# Altium schematic sheet Input.SchDoc
size A4; SheetNumber: 3; SheetTotal: 6
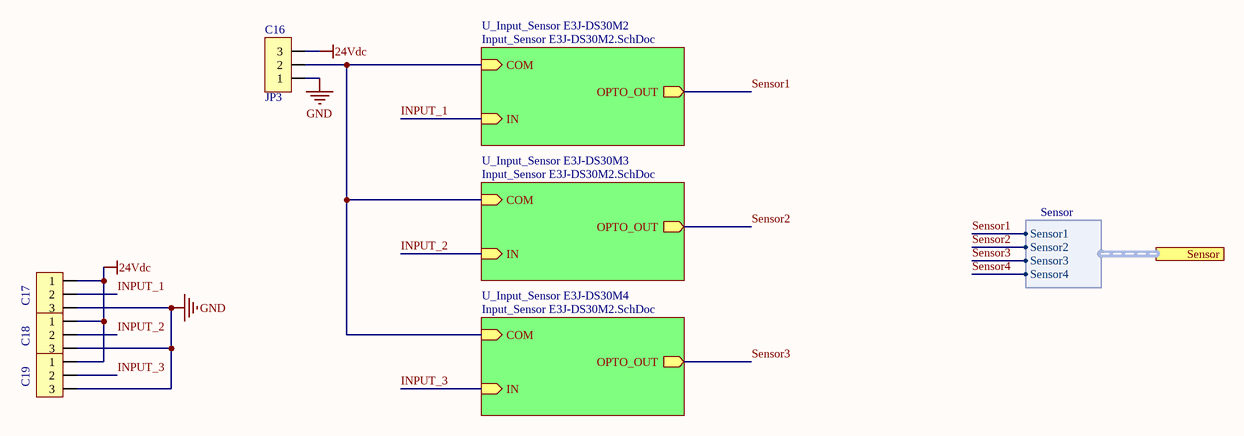
[diagram p0: Input.SchDoc]

## Parts
C16  JP3  [JP3-CLOSED]
C17  Header3  [Header3 90]  (value not drawn)
C18  Header3  [Header3 90]  (value not drawn)
C19  Header3  [Header3 90]  (value not drawn)

## Sub-sheets
U_Input_Sensor E3J-DS30M2 = Input_Sensor E3J-DS30M2.SchDoc: COM (in), IN (in), OPTO_OUT (out)
U_Input_Sensor E3J-DS30M3 = Input_Sensor E3J-DS30M2.SchDoc: COM (in), IN (in), OPTO_OUT (out)
U_Input_Sensor E3J-DS30M4 = Input_Sensor E3J-DS30M2.SchDoc: COM (in), IN (in), OPTO_OUT (out)

## Ports
Sensor (harness Sensor)

## Harnesses
Sensor: Sensor1, Sensor2, Sensor3, Sensor4

## Nets
24Vdc: C16.3 C17.1 C18.1 C19.1
GND: C16.1 C17.3 C18.3 C19.3
INPUT_1: C17.2 ; sheet U_Input_Sensor E3J-DS30M2/IN
INPUT_2: C18.2 ; sheet U_Input_Sensor E3J-DS30M3/IN
INPUT_3: C19.2 ; sheet U_Input_Sensor E3J-DS30M4/IN
Sensor1: sheet U_Input_Sensor E3J-DS30M2/OPTO_OUT, port Sensor.Sensor1
Sensor2: sheet U_Input_Sensor E3J-DS30M3/OPTO_OUT, port Sensor.Sensor2
Sensor3: sheet U_Input_Sensor E3J-DS30M4/OPTO_OUT, port Sensor.Sensor3
Sensor4: port Sensor.Sensor4
NetC16_2: C16.2 ; sheet U_Input_Sensor E3J-DS30M2/COM, sheet U_Input_Sensor E3J-DS30M3/COM, sheet U_Input_Sensor E3J-DS30M4/COM

## Notes on the sheet
- Title
- Size:
- Date:
- A3
- Number:
- Time:
- Revision:
- Sheet
- of
- NICHIETSUVN.COM <http://NICHIETSUVN.COM>
- R&D
- File:

## Library data of the parts
C16 = JP3: WR-PHD 2.54 mm Angled Socket Header; Manufacturer: W¨¹rth Elektronik eiSos GmbH; partNo: 613003143121; ComponentLink1 Description: Manufacturer; ComponentLink2 Description: Datasheet; NoPins: 03; Created Date: 29 March 2013; ComponentLink1URL: http://www.we-online.com; ComponentLink2URL: http://katalog.we-online.de/em/datasheet/6130xx143121.pdf; Created by: Karrer Zheng
C17-C19 = Header3: Header IDC, 3 x 1 Pin Vertical 2.54mm Pitch (Non-Boxed, Male); Manufacturer: W¨¹rth Elektronik eiSos GmbH; partNo: 613002143121; ComponentLink1 Description: Manufacturer; ComponentLink2 Description: Datasheet; NoPins: 02; Created Date: 29 March 2013; ComponentLink1URL: http://www.we-online.com; ComponentLink2URL: http://katalog.we-online.de/em/datasheet/6130xx143121.pdf; Created by: Karrer Zheng